# EasyEDA Pro project ProPrj_集成Windows Hello指纹、DIAL、HUB的桌面工具_2024-08-31.epro

# Schematic Schematic1
Create Date: 2024-07-15; Page Name: P1; Project Name: 集成Windows Hello指纹、DIAL、HUB的桌面工具; Schematic Name: Schematic1; Update Date: 2024-07-15; Company: 嘉立创EDA; Page Size: A3; Version: V1.0
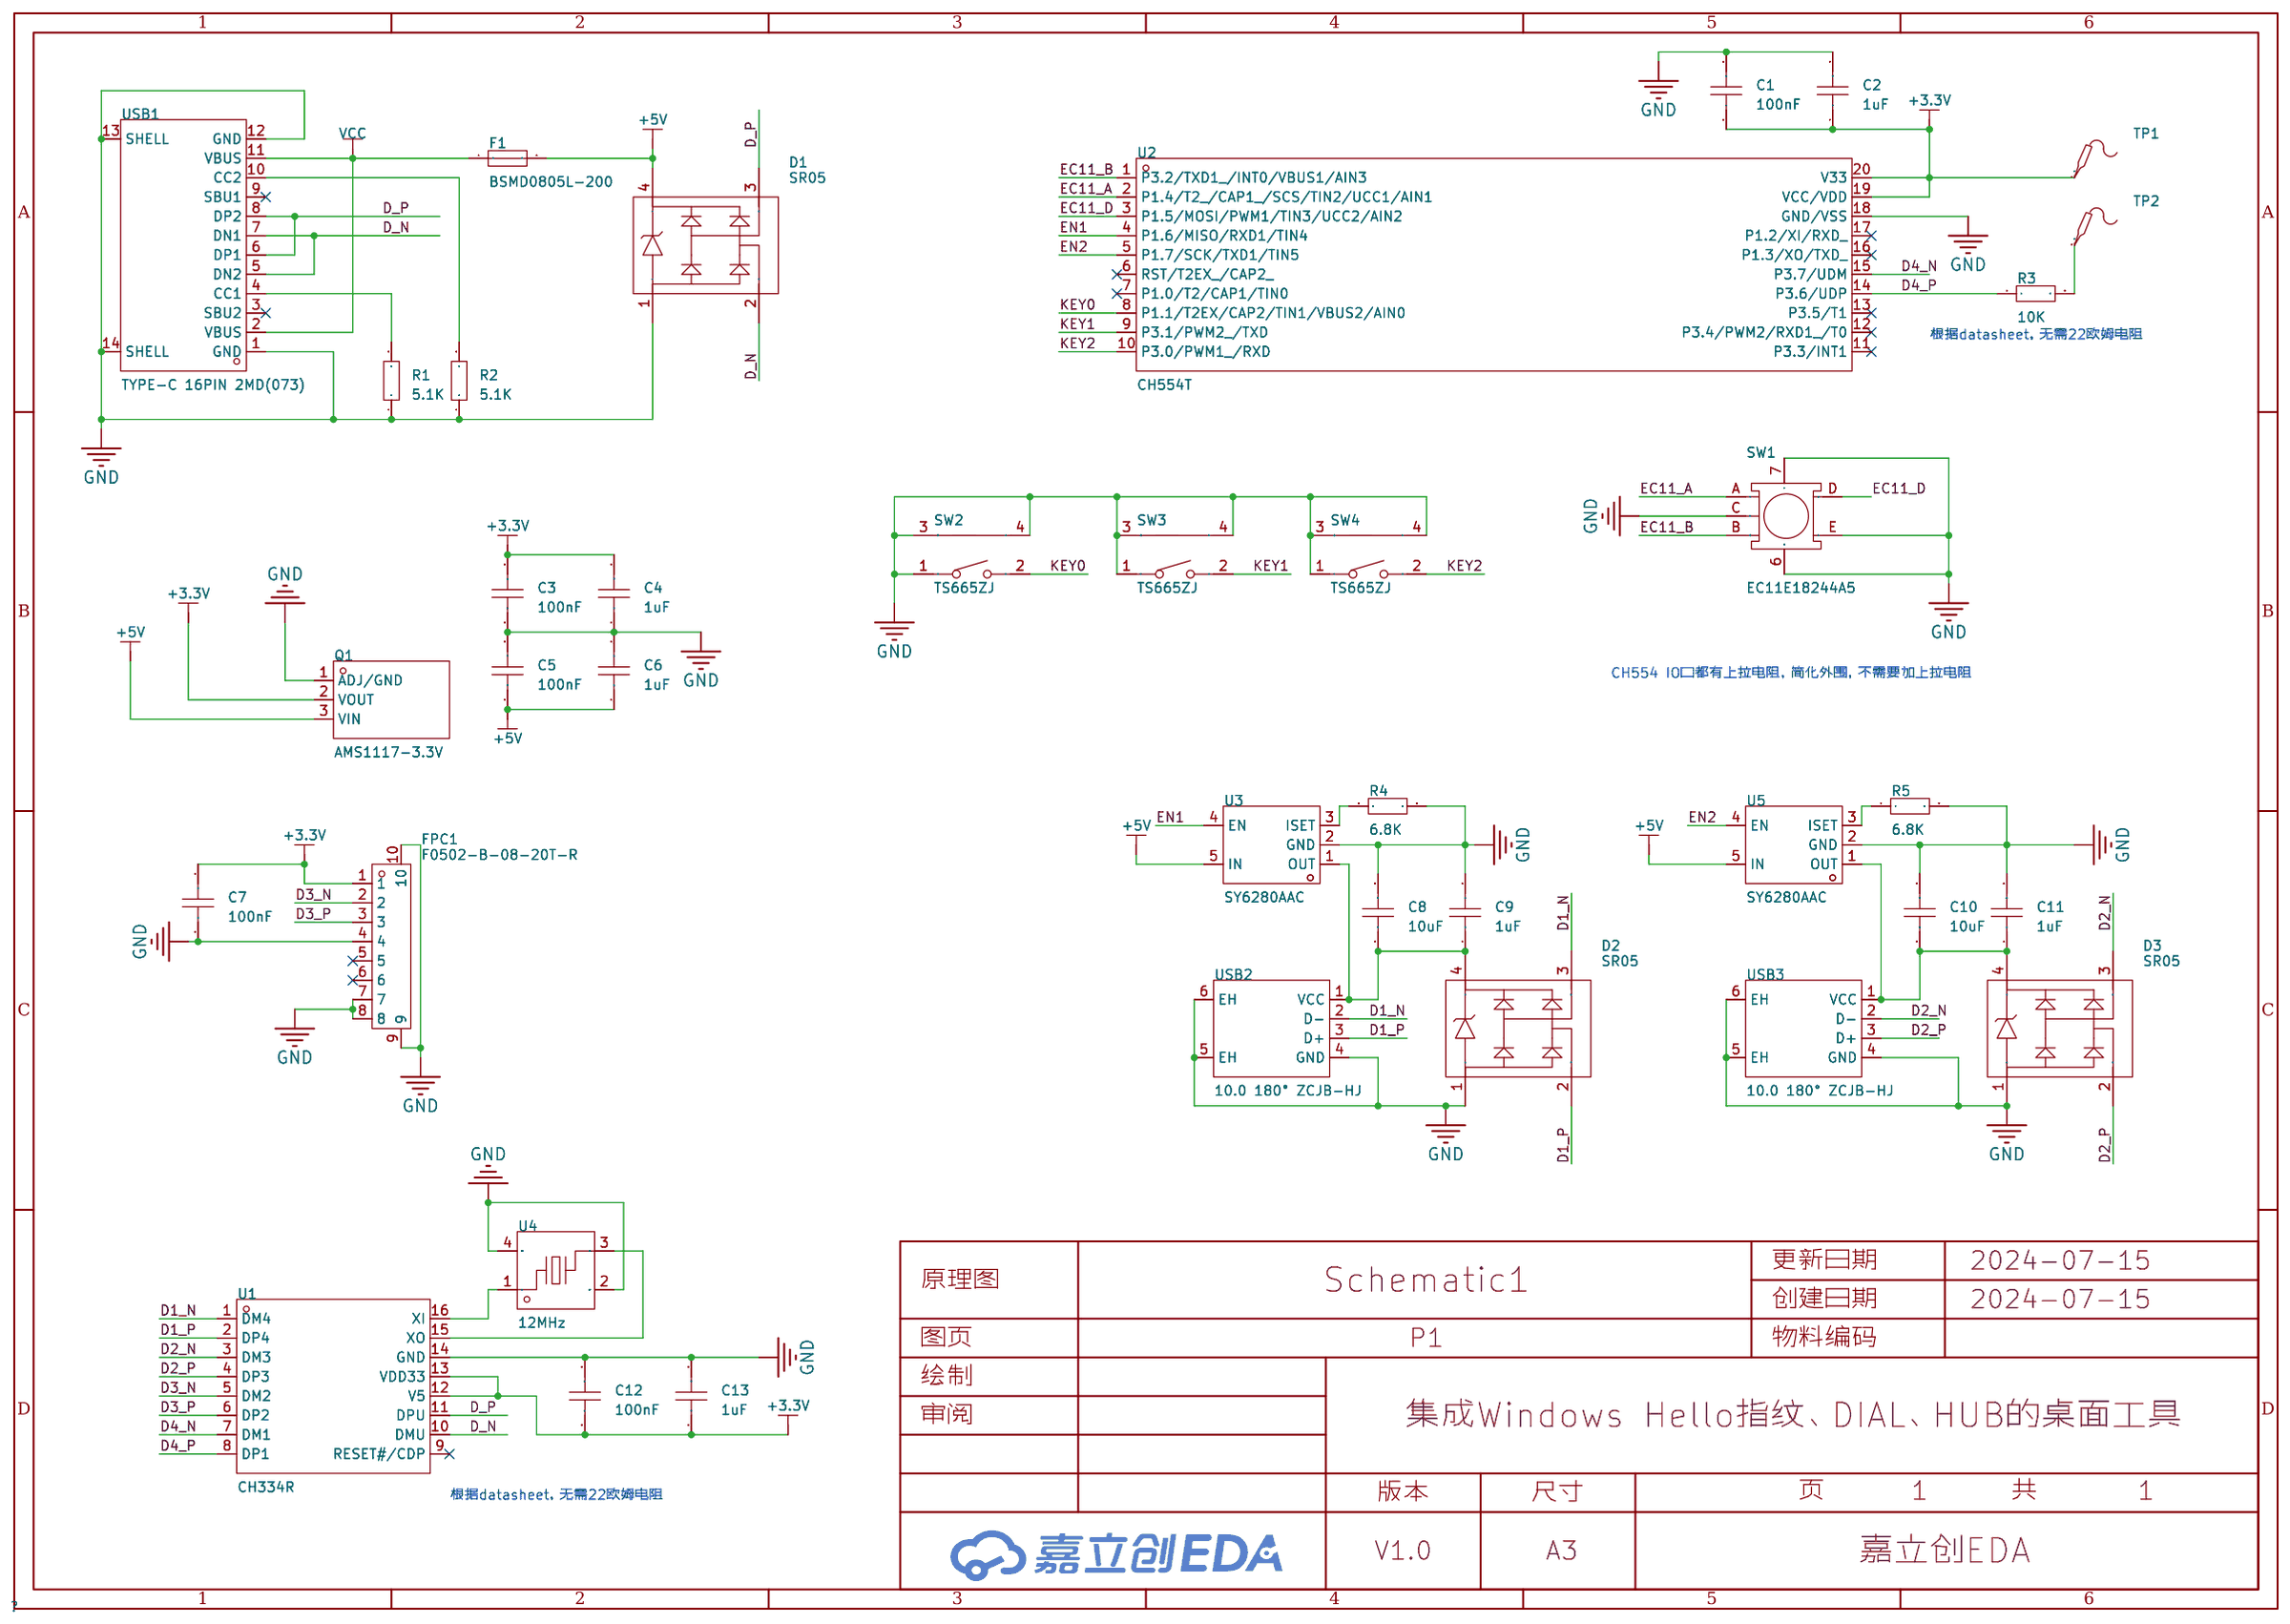
[diagram p0: schematic sheet]

## Parts
C1  100nF  [C0603]
C2  1uF  [C0603]
C3  100nF  [C0603]
C4  1uF  [C0603]
C5  100nF  [C0603]
C6  1uF  [C0603]
C7  100nF  [C0603]
C8  10uF  [C0603]
C9  1uF  [C0603]
C10  10uF  [C0603]
C11  1uF  [C0603]
C12  100nF  [C0603]
C13  1uF  [C0603]
D1  SR05  [SOT-143-4_L2.9-W1.3-P1.90-LS2.4-BL]
D2  SR05  [SOT-143-4_L2.9-W1.3-P1.90-LS2.4-BL]
D3  SR05  [SOT-143-4_L2.9-W1.3-P1.90-LS2.4-BL]
F1  BSMD0805L-200  [F0805]
FPC1  F0502-B-08-20T-R  [FPC-SMD_F0502-B-08-20T-R]
Q1  AMS1117-3.3V  [SOT-89-3_L4.5-W2.5-P1.50-LS4.2-BR]
R1  5.1K  [R0603]
R2  5.1K  [R0603]
R3  10K  [R0603]
R4  6.8K  [R0603]
R5  6.8K  [R0603]
SW1  EC11E18244A5  [SW-TH_EC11E18244A5]
SW2  TS665ZJ  [SW-TH_K2-1102BQ-G4CW-01]
SW3  TS665ZJ  [SW-TH_K2-1102BQ-G4CW-01]
SW4  TS665ZJ  [SW-TH_K2-1102BQ-G4CW-01]
TP1  -  [Test-Point-0.5mm]
TP2  -  [Test-Point-0.5mm]
U1  CH334R  [QSOP-16_L4.9-W3.9-P0.64-LS6.0-BL]
U2  CH554T  [TSSOP-20_L6.5-W4.4-P0.65-LS6.4-TL]
U3  SY6280AAC  [SOT-23-5_L3.0-W1.7-P0.95-LS2.8-BL]
U4  12MHz  [CRYSTAL-SMD_4P-L3.2-W2.5-BL]
U5  SY6280AAC  [SOT-23-5_L3.0-W1.7-P0.95-LS2.8-BL]
USB1  TYPE-C 16PIN 2MD(073)  [USB-C-SMD_TYPE-C-6PIN-2MD-073]
USB2  10.0 180° ZCJB-HJ  [USB-A-TH_ZCJB-HJ]
USB3  10.0 180° ZCJB-HJ  [USB-A-TH_ZCJB-HJ]

## Library data of the parts
C1-C13 = CAP_0603: Supplier Footprint: 0603
D1-D3 = SR05: Supplier Part: C782796; Manufacturer: SEMBO(深波); Supplier Footprint: SOT-143-4; JLCPCB Part Class: 扩展库; Datasheet: https://atta.szlcsc.com/upload/public/pdf/source/20210514/C782796_472BBF7C41E5A6E8ADB7E6EF91A8F050.pdf; Supplier: LCSC
F1 = BSMD0805L-200: 最大电压:6V;最大电流:50A;保持电流:2A;跳闸电流:4A;; LCSC Part Name: 6V 2A 0805自恢复; Supplier Part: C2757931; Manufacturer: BHFUSE(佰宏); Supplier Footprint: 0805; JLCPCB Part Class: 扩展库; Datasheet: https://atta.szlcsc.com/upload/public/pdf/source/20230512/2A38E917D8C71AC0E9EEF3F28FAD09E2.pdf; Supplier: LCSC; Operating Voltage (Max): 6V; Current Rating (Max): 50A; Hold Current: 2A; Trip Current: 4A; Power Dissipation: 1W; Resistance - Initial (Ri) (Min): 4mΩ; Resistance - Post Trip (R1) (Max): 45mΩ; Maximum Time to Trip: 5s; Operating Temperature: -40℃~+85℃
FPC1 = F0502-B-08-20T-R: 锁定特性:翻盖式;触点类型:下接;触点数量:8P;间距:0.5mm;安装类型:卧贴;; LCSC Part Name: 间距:0.5mm P数:8P 翻盖式 下接; Supplier Part: C481218; Manufacturer: XFCN(兴飞); Supplier Footprint: SMD,P=0.5mm,卧贴; JLCPCB Part Class: 扩展库; Datasheet: https://atta.szlcsc.com/upload/public/pdf/source/20200107/C481223_B24B2F420CEE1C498EA7D8BD00017249.pdf; Supplier: LCSC; Locking Feature: 翻盖式; Contact Type: 下接; Number of Contacts: 8P; Pitch: 0.5mm; Mounting Type: 卧贴; Height Above Board: 2mm
Q1 = AMS1117-3.3V_C5120796: 输出类型:固定;最大输入电压:18V;输出电压:3.3V;最大输出电流:1A;输出极性:正极;; LCSC Part Name: 输入18V 输出3.3V 1A; Supplier Part: C5120796; Manufacturer: MSKSEMI(美森科); Supplier Footprint: SOT-89; JLCPCB Part Class: 扩展库; Datasheet: https://atta.szlcsc.com/upload/public/pdf/source/20220727/5E62EAC46FFFF83337622C0FBE1B6BF8.pdf; Supplier: LCSC; Output Type: 固定; Maximum Input Voltage: 18V; Output Voltage: 3.3V; MAX Output Current: 1A; Dropout Voltage: 1.4V@(1A); standby current: 12mA; Operating Temperature: 0℃~+125℃; Output Polarity: 正极; Number of Outputs: 1
R1-R5 = Res_0603: Supplier Footprint: 0603
SW1 = EC11E18244A5: Supplier Part: C255515; Manufacturer: ALPSALPINE(阿尔卑斯阿尔派); Supplier Footprint: 插件; JLCPCB Part Class: 扩展库; Datasheet: https://atta.szlcsc.com/upload/public/pdf/source/20180717/C255515_FDB072715C920DA9BADE9D32EFEB8093.pdf; Supplier: LCSC
SW2-SW4 = TS665ZJ: 电路结构:单刀单掷;按钮形状:圆形按钮;作用力:250gf;安装方式:卧插;开关长度:6.2mm;开关宽度:6.2mm;开关高度:5mm;带支架:带支架;触点电流:50mA;额定电压(DC):12V;绝缘电阻:100MΩ;机械寿命:5万次;; LCSC Part Name: 6.2*6.2*5mm 卧插 轻触开关; Supplier Part: C557599; Manufacturer: SHOU HAN(首韩); Supplier Footprint: 插件; JLCPCB Part Class: 扩展库; Datasheet: https://atta.szlcsc.com/upload/public/pdf/source/20200519/C557599_C93058E34E1879225DC935A3AAEF7EAA.pdf; Supplier: LCSC; Circuit: 单刀单掷; Actuator Style: 圆形按钮; Operating Force: 250gf; Mounting Style: 卧插; Switch Length: 6.2mm; Switch Width: 6.2mm; Switch Height: 5mm; Strike Gundam: 带支架; Contact Current: 50mA; Voltage Rating (DC): 12V; Insulation Resistance: 100MΩ; Actuator/Cap Color: 黑色; Pin Style: PC引脚; Mechanical Life: 5万次
TP1 TP2 = Test-Point: Test Point 测试点
U1 = CH334R: Supplier Part: C4154405; Manufacturer: WCH(南京沁恒); Supplier Footprint: QSOP-16-150mil; JLCPCB Part Class: 扩展库; Datasheet: https://atta.szlcsc.com/upload/public/pdf/source/20240313/F70B229B132CE2CA6E618A7ACAF406E8.pdf; Supplier: LCSC
U2 = CH554T: Supplier Part: C2928938; Manufacturer: WCH(南京沁恒); Supplier Footprint: TSSOP-20; JLCPCB Part Class: 扩展库; Datasheet: https://atta.szlcsc.com/upload/public/pdf/source/20200819/C106886_FA0172974EAB526EA9ED6EAC69AA4F1B.pdf; Supplier: LCSC
U3 U5 = SY6280AAC_C55136: 低能耗配电开关; Supplier Part: C55136; Manufacturer: silergy(矽力杰); Supplier Footprint: SOT-23-5; JLCPCB Part Class: 扩展库; Datasheet: https://atta.szlcsc.com/upload/public/pdf/source/20161108/1478586372822.pdf; Supplier: LCSC
U4 = X322541201210A: 频率:12MHz;常温频差:±10ppm;外接负载电容:12pF;频率稳定度(全温):±30ppm;; LCSC Part Name: 12MHz ±10ppm 12pF; Supplier Part: C5128505; Manufacturer: Starwave(思大); Supplier Footprint: SMD3225-4P; JLCPCB Part Class: 扩展库; Datasheet: https://atta.szlcsc.com/upload/public/pdf/source/20220831/A7AEECC803A5F89437D8880B21203D0B.pdf; Supplier: LCSC; Normal temperature Frequency Tolerance: ±10ppm; External load capacitor: 12pF; Frequency Stability(Full temperature range): ±30ppm; Equivalent Series Resistance (ESR): 50Ω; Operating Temperature: -40℃~+85℃
USB1 = TYPE-C 16PIN 2MD(073): 连接器类型:Type-C;标准:-;公母:母;端口数量:1;触点数量:16P;安装方式:卧贴;额定电流 - 电源:5A;工作温度范围:-25℃~+85℃;; LCSC Part Name: Type-C 母 卧贴; Supplier Part: C2765186; Manufacturer: SHOU HAN(首韩); Supplier Footprint: SMD; JLCPCB Part Class: 扩展库; Datasheet: https://atta.szlcsc.com/upload/public/pdf/source/20211123/39B17C16241EAC15C5E277BDA434118E.pdf; Supplier: LCSC; Connector Type: Type-C; Gender: 母; Number of Ports: 1; Number of Contacts: 16P; Mounting Style: 卧贴; Current Rating - Power (Max): 5A; Operating Temperature Range: -25℃~+85℃
USB2 USB3 = 10.0 180° ZCJB-HJ: 连接器类型:Type-A;标准:USB 2.0;公母:母;端口数量:1;触点数量:4P;安装方式:直插;额定电流 - 电源:1.5A;工作温度范围:-25℃~+85℃;; LCSC Part Name: Type-A 母 直插; Supplier Part: C2681562; Manufacturer: SHOU HAN(首韩); Supplier Footprint: 插件; JLCPCB Part Class: 扩展库; Datasheet: https://atta.szlcsc.com/upload/public/pdf/source/20210122/C2681562_F87A6740E9F2C84060948B1B5DBCB2C0.pdf; Supplier: LCSC; Connector Type: Type-A; Standard: USB 2.0; Gender: 母; Number of Ports: 1; Number of Contacts: 4P; Mounting Style: 直插; Current Rating - Power (Max): 1.5A; Operating Temperature Range: -25℃~+85℃

## Nets
+3.3V: C1.1 C2.1 C3.2 C4.2 C7.1 C12.1 C13.1 FPC1.1 Q1.2(VOUT) TP1.1 U1.12(V5) U1.13(VDD33) U2.19(VCC/VDD) U2.20(V33)
+5V: C5.1 C6.1 D1.4 F1.2 Q1.3(VIN) U3.5(IN) U5.5(IN)
GND: C1.2 C2.2 C3.1 C4.1 C5.2 C6.2 C7.2 C8.2 C9.2 C10.2 C11.2 C12.2 C13.2 D1.1 D2.1 D3.1 FPC1.4 FPC1.7 FPC1.8 FPC1.9 FPC1.10 Q1.1(ADJ/GND) R1.1 R2.1 R4.2 R5.2 SW1.6 SW1.7 SW1.C SW1.E SW2.1 SW2.3 SW2.4 SW3.1 SW3.3 SW3.4 SW4.1 SW4.3 SW4.4 U1.14(GND) U2.18(GND/VSS) U3.2(GND) U4.2(GND) U4.4(GND) U5.2(GND) USB1.1(GND) USB1.12(GND) USB1.13(SHELL) USB1.14(SHELL) USB2.4(GND) USB2.5(EH) USB2.6(EH) USB3.4(GND) USB3.5(EH) USB3.6(EH)
VCC: F1.1 USB1.2(VBUS) USB1.11(VBUS)
D1_N: D2.3 U1.1(DM4) USB2.2(D-)
D1_P: D2.2 U1.2(DP4) USB2.3(D+)
D2_N: D3.3 U1.3(DM3) USB3.2(D-)
D2_P: D3.2 U1.4(DP3) USB3.3(D+)
D3_N: FPC1.2 U1.5(DM2)
D3_P: FPC1.3 U1.6(DP2)
D4_N: U1.7(DM1) U2.15(P3.7/UDM)
D4_P: R3.1 U1.8(DP1) U2.14(P3.6/UDP)
D_N: D1.2 U1.10(DMU) USB1.5(DN2) USB1.7(DN1)
D_P: D1.3 U1.11(DPU) USB1.6(DP1) USB1.8(DP2)
EC11_A: SW1.A U2.2(P1.4/T2_/CAP1_/SCS/TIN2/UCC1/AIN1)
EC11_B: SW1.B U2.1(P3.2/TXD1_/INT0/VBUS1/AIN3)
EC11_D: SW1.D U2.3(P1.5/MOSI/PWM1/TIN3/UCC2/AIN2)
EN1: U2.4(P1.6/MISO/RXD1/TIN4) U3.4(EN)
EN2: U2.5(P1.7/SCK/TXD1/TIN5) U5.4(EN)
KEY0: SW2.2 U2.8(P1.1/T2EX/CAP2/TIN1/VBUS2/AIN0)
KEY1: SW3.2 U2.9(P3.1/PWM2_/TXD)
KEY2: SW4.2 U2.10(P3.0/PWM1_/RXD)
$1N1071: R1.2 USB1.4(CC1)
$1N1075: R2.2 USB1.10(CC2)
$1N1604: U1.16(XI) U4.1
$1N1608: U1.15(XO) U4.3
$1N3135: C10.1 C11.1 D3.4 U5.1(OUT) USB3.1(VCC)
$1N3142: C8.1 C9.1 D2.4 U3.1(OUT) USB2.1(VCC)
$1N3230: R5.1 U5.3(ISET)
$1N3240: R4.1 U3.3(ISET)
$1N4441: R3.2 TP2.1

Not connected (* = marked no-connect by the designer): FPC1 5* 6*; U1 9(RESET#/CDP)*; U2 6(RST/T2EX_/CAP2_)* 7(P1.0/T2/CAP1/TIN0)* 11(P3.3/INT1)* 12(P3.4/PWM2/RXD1_/T0)* 13(P3.5/T1)* 16(P1.3/XO/TXD_)* 17(P1.2/XI/RXD_)*; USB1 3(SBU2)* 9(SBU1)*

## Notes on the sheet
- 根据datasheet，无需22欧姆电阻
- CH554 IO口都有上拉电阻，简化外围，不需要加上拉电阻
- 根据datasheet，无需22欧姆电阻

# Board PCB1
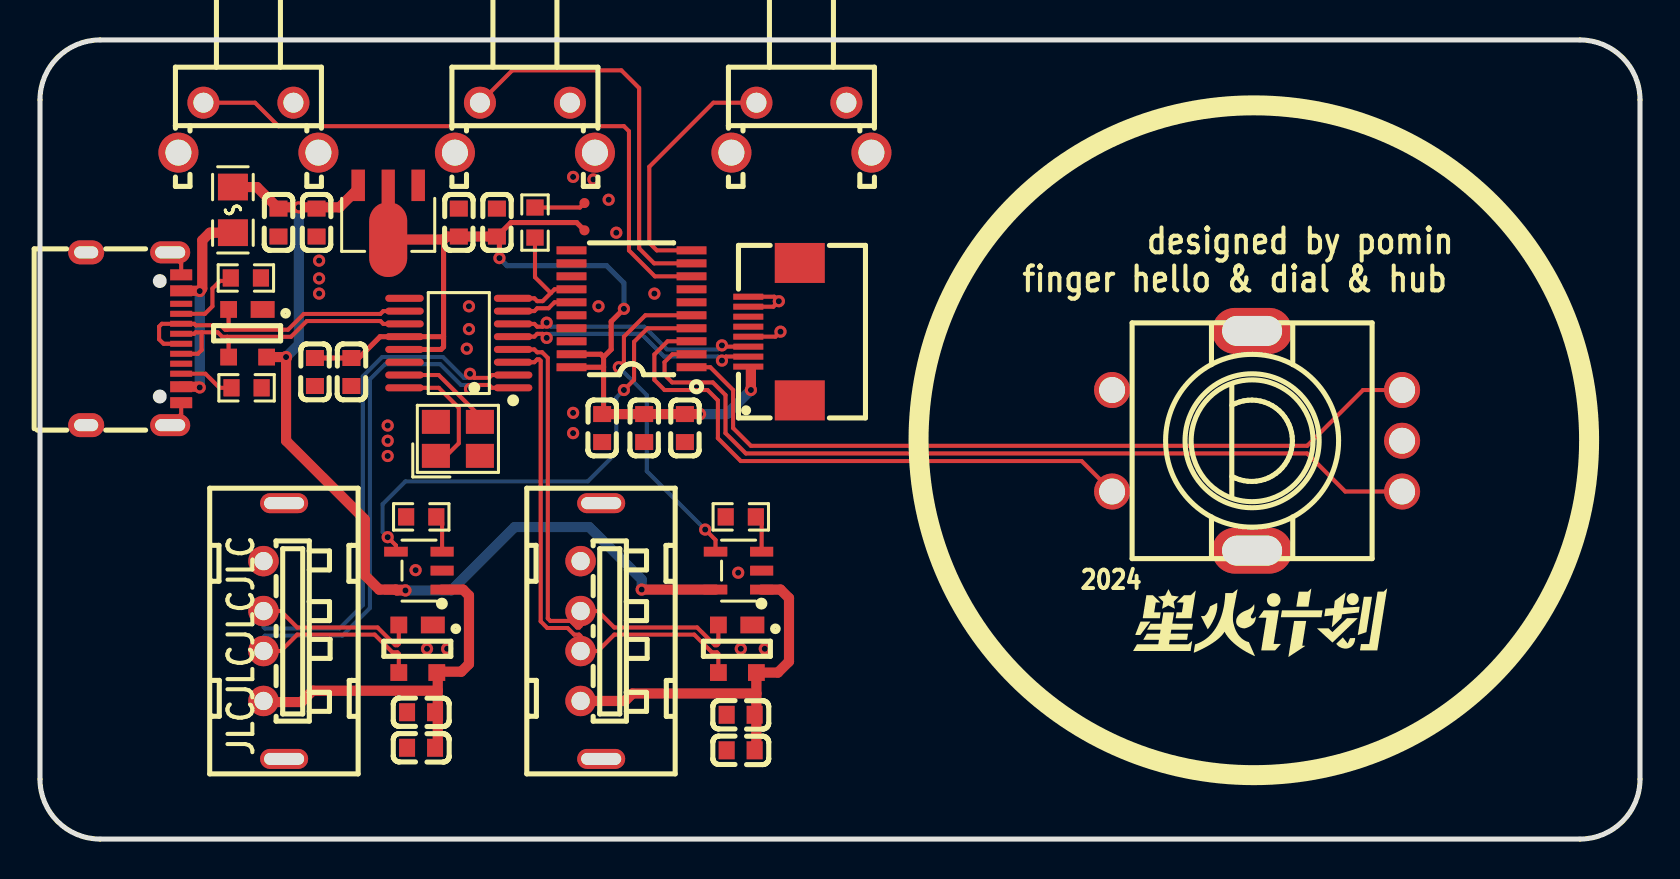
[diagram p1: board, top side]
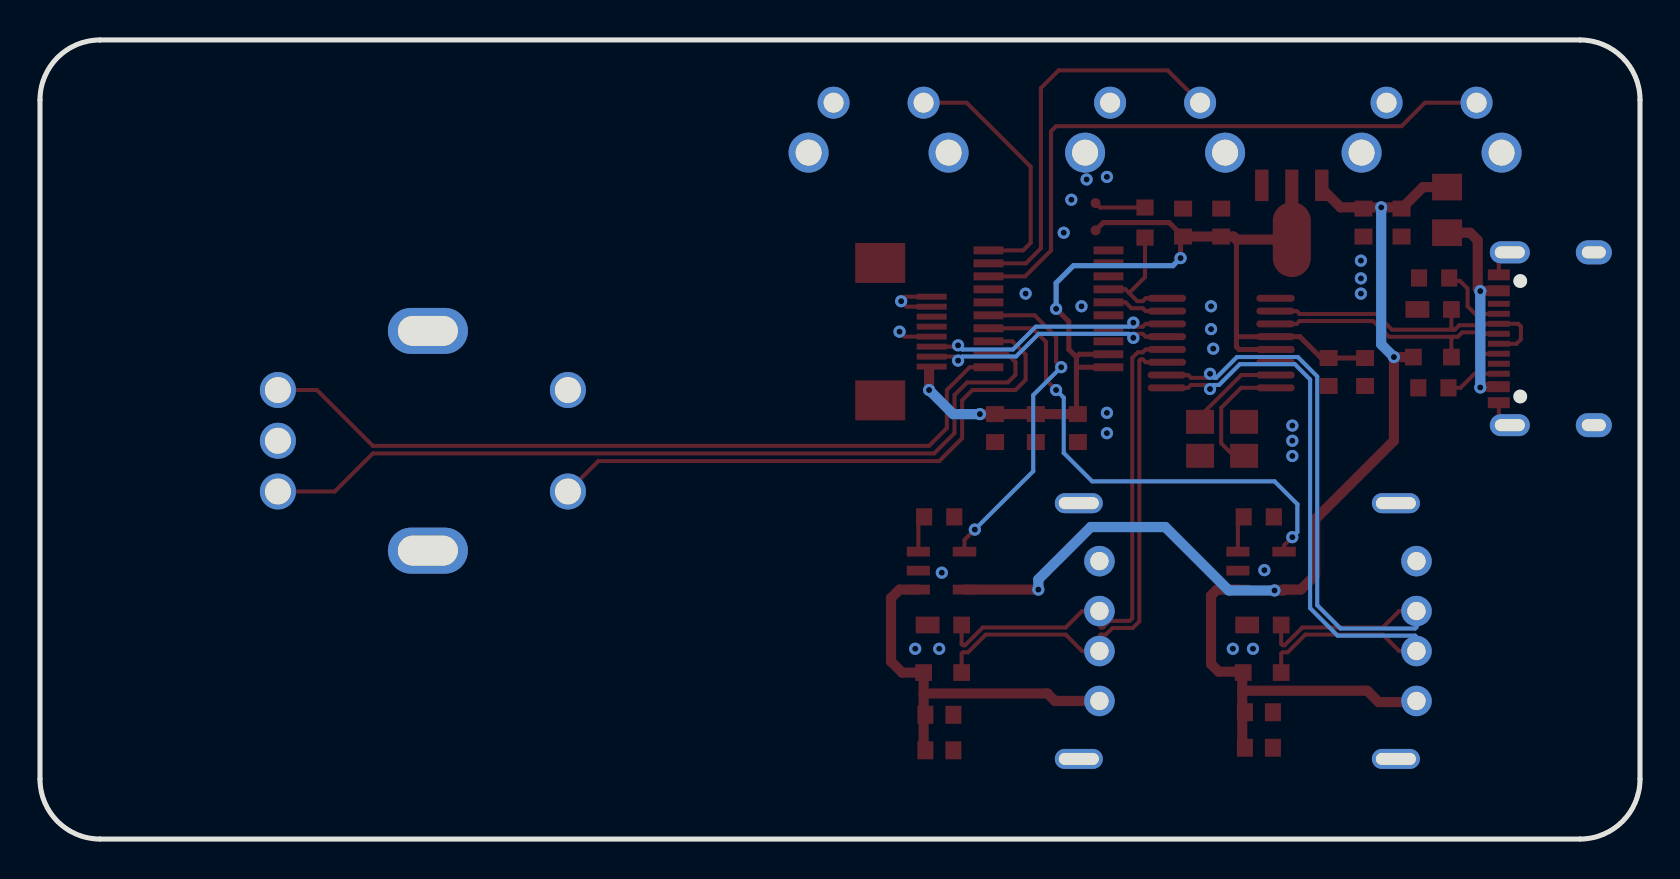
[diagram p2: board, bottom side, seen from below]

Outline 80 x 40 mm; copper layers: Top Layer, Bottom Layer. Coordinates in mm from the lower left corner of the outline.
Outline path: 0,37 arc(0.88,39.12) 3,40 77,40 arc(79.12,39.12) 80,37 80,3 arc(79.12,0.88) 77,0 3,0 arc(0.88,0.88) 0,3 0,37
Stack: Top Layer 0.035mm / Dielectric1 1.51mm FR4 er 4.5 / Bottom Layer 0.035mm

## Design rules (mm)
net D1_N: DP5
net D1_P: DP5
net D2_N: DP4
net D2_P: DP4
net D3_N: DP3
net D3_P: DP3
net D4_N: DP2
net D4_P: DP2
net D_P: DP1
net D_N: DP1
template: JLCPCB Capability(Two Layers Board)
spacing copperThickness1oz (default): track to track 0.102, other pairs 0.152 to 0.3
spacing copperThickness2oz: track to track 0.203, other pairs 0.152 to 0.3
track width copperThickness1oz (default): min 0.127, default 0.254, max 2.54
track width copperThickness2oz: min 0.203, default 0.254, max 2.54
differential pair differentialPair (default): width min 0.127, default 0.254, max 2.54; gap min 0.152, default 0.152
via viaSize (default): diameter min 0.5, default 0.61, max 10; hole min 0.3, default 0.305, max 6.3

## Placement (name value [footprint] x y rotation side)
C1  100nF  [C0603]  28.11 20.57 270 top
C2  1uF  [C0603]  30.21 20.57 270 top
C3  100nF  [C0603]  22.85 30.86 270 top
C4  1uF  [C0603]  20.94 30.86 270 top
C5  100nF  [C0603]  13.83 30.86 270 top
C6  1uF  [C0603]  11.92 30.86 270 top
C7  100nF  [C0603]  32.25 20.57 270 top
C8  10uF  [C0603]  19.05 6.35 180 top
C9  1uF  [C0603]  19.05 4.57 180 top
C10  10uF  [C0603]  35.03 6.22 180 top
C11  1uF  [C0603]  35.03 4.44 180 top
C12  100nF  [C0603]  15.57 23.38 270 top
C13  1uF  [C0603]  13.75 23.38 270 top
D1  SR05  [SOT-143-4_L2.9-W1.3-P1.90-LS2.4-BL]  10.38 25.32 180 top
D2  SR05  [SOT-143-4_L2.9-W1.3-P1.90-LS2.4-BL]  18.89 9.52 180 top
D3  SR05  [SOT-143-4_L2.9-W1.3-P1.90-LS2.4-BL]  34.87 9.52 180 top
F1  BSMD0805L-200  [F0805]  9.65 31.49 90 top
FPC1  F0502-B-08-20T-R  [FPC-SMD_F0502-B-08-20T-R]  36.7 25.4 90 top
Q1  AMS1117-3.3V  [SOT-89-3_L4.5-W2.5-P1.50-LS4.2-BR]  17.41 31.37 90 top
R1  5.1K  [R0603]  10.29 28.08 180 top
R2  5.1K  [R0603]  10.33 22.59 180 top
R3  10K  [R0603]  24.75 30.86 90 top
R4  6.8K  [R0603]  19.06 16.13 180 top
R5  6.8K  [R0603]  35.04 16.13 180 top
SW1  EC11E18244A5  [SW-TH_EC11E18244A5]  60.86 19.94 90 top
SW2  TS665ZJ  [SW-TH_K2-1102BQ-G4CW-01]  10.42 35.61 180 top
SW3  TS665ZJ  [SW-TH_K2-1102BQ-G4CW-01]  24.25 35.61 180 top
SW4  TS665ZJ  [SW-TH_K2-1102BQ-G4CW-01]  38.07 35.61 180 top
TP1  -  [Test-Point-0.5mm]  27.22 30.47 180 top
TP2  -  [Test-Point-0.5mm]  27.22 31.84 180 top
U1  CH334R  [QSOP-16_L4.9-W3.9-P0.64-LS6.0-BL]  20.94 24.83 90 top
U2  CH554T  [TSSOP-20_L6.5-W4.4-P0.65-LS6.4-TL]  29.58 26.54 180 top
U3  SY6280AAC  [SOT-23-5_L3.0-W1.7-P0.95-LS2.8-BL]  18.95 13.44 90 top
U4  12MHz  [CRYSTAL-SMD_4P-L3.2-W2.5-BL]  20.9 20.03 0 top
U5  SY6280AAC  [SOT-23-5_L3.0-W1.7-P0.95-LS2.8-BL]  34.93 13.44 90 top
USB1  TYPE-C 16PIN 2MD(073)  [USB-C-SMD_TYPE-C-6PIN-2MD-073]  4.68 25.04 270 top
USB2  10.0 180° ZCJB-HJ  [USB-A-TH_ZCJB-HJ]  11.69 10.41 90 top
USB3  10.0 180° ZCJB-HJ  [USB-A-TH_ZCJB-HJ]  27.54 10.41 90 top

## Footprints (pads in the part's own frame, mm; a bottom-side part is the same pattern mirrored in y, then rotated)
C0603
  rect 0.8x0.9 smd: 1(-0.7,0) 2(0.7,0)
CRYSTAL-SMD_4P-L3.2-W2.5-BL
  rect 1.4x1.2 smd: 1(-1.1,-0.85) 2(1.1,-0.85) 3(1.1,0.85) 4(-1.1,0.85)
F0805
  rect 1.335x1.5 smd: 1(-1.143,0) 2(1.143,0)
FPC-SMD_F0502-B-08-20T-R
  rect 0.3x1.5 smd: 1(-1.75,1.288) 2(-1.25,1.288) 3(-0.75,1.288) 4(-0.25,1.288) 5(0.25,1.288) 6(0.75,1.288) 7(1.25,1.288) 8(1.75,1.288)
  rect 2x2.5 smd: 9(3.44,-1.288) 10(-3.44,-1.288)
QSOP-16_L4.9-W3.9-P0.64-LS6.0-BL
  oval 0.35x1.921 smd: 1(-2.24,-2.716) 2(-1.6,-2.716) 3(-0.96,-2.716) 4(-0.32,-2.716) 5(0.32,-2.716) 6(0.96,-2.716) 7(1.6,-2.716) 8(2.24,-2.716) 9(2.24,2.716) 10(1.6,2.716) 11(0.96,2.716) 12(0.32,2.716) 13(-0.32,2.716) 14(-0.96,2.716) 15(-1.6,2.716) 16(-2.24,2.716)
R0603
  rect 0.806x0.864 smd: 1(-0.753,0) 2(0.753,0)
SOT-23-5_L3.0-W1.7-P0.95-LS2.8-BL
  rect 0.49x1.157 smd: 1(-0.95,-1.153) 2(0,-1.153) 3(0.95,-1.153)
  rect 0.49x1.175 smd: 4(0.95,1.153) 5(-0.95,1.153)
SOT-89-3_L4.5-W2.5-P1.50-LS4.2-BR
  rect 1.575x0.672 smd: 1(1.356,-1.5) 3(1.356,1.5)
  custom 5.377x1.9 smd: 2(-1.356,0)
SOT-143-4_L2.9-W1.3-P1.90-LS2.4-BL
  rect 1.194x0.838 smd: 1(-0.75,-1.192)
  rect 0.838x0.838 smd: 2(0.95,-1.192) 3(0.95,1.192) 4(-0.95,1.192)
SW-TH_EC11E18244A5
  oval 2.3x4 hole 1.5x3: 6(5.5,0.25) 7(-5.5,0.25)
  round 1.8 hole 1.3: A(-2.54,-7.25) B(2.54,-7.25) C(0,-7.25) D(-2.54,7.25) E(2.54,7.25)
SW-TH_K2-1102BQ-G4CW-01
  round 1.6 hole 1: 1(-2.25,-1.25) 2(2.25,-1.25)
  round 2 hole 1.3: 3(3.5,1.25) 4(-3.5,1.25)
Test-Point-0.5mm
  round 0.5 smd: 1(0,0)
TSSOP-20_L6.5-W4.4-P0.65-LS6.4-TL
  rect 1.494x0.4 smd: 1(-3.001,2.925) 2(-3.001,2.275) 3(-3.001,1.625) 4(-3.001,0.975) 5(-3.001,0.325) 6(-3.001,-0.324) 7(-3.001,-0.975) 8(-3.001,-1.625) 9(-3.001,-2.275) 10(-3.001,-2.925) 11(3.001,-2.925) 12(3.001,-2.275) 13(3.001,-1.625) 14(3.001,-0.975) 15(3.001,-0.325) 16(3.001,0.325) 17(3.001,0.975) 18(2.996,1.625) 19(2.996,2.275) 20(3.001,2.925)
USB-A-TH_ZCJB-HJ
  round 1.524 hole 0.914: 1(-3.5,0.515) 2(-1.001,0.515) 3(1,0.515) 4(3.5,0.515)
  oval 1x2.4 hole 0.6x2: 5(-6.4,-0.515) 6(6.4,-0.515)
USB-C-SMD_TYPE-C-6PIN-2MD-073
  rect 0.55x1.1 smd: 1(-3.2,2.375) 2(-2.4,2.375) 11(2.4,2.375) 12(3.2,2.375)
  rect 0.3x1.1 smd: 3(-1.75,2.375) 4(-1.25,2.375) 5(-0.75,2.375) 6(-0.25,2.375) 7(0.25,2.375) 8(0.75,2.375) 9(1.25,2.375) 10(1.75,2.375)
  oval 1.1x2 hole 0.6x1.5: 13(-4.325,1.825) 14(4.325,1.825)
  oval 1.2x1.8 hole 0.6x1.2: 13(-4.325,-2.375) 14(4.325,-2.375)

## Nets
As in the schematic.

Pads without a net: FPC1 5 6; U1 9; U2 6 7 11 12 13 16 17; USB1 3 9

## Via types
v1: diameter 0.61, hole 0.305, Top Layer to Bottom Layer, 45 vias

## Routing (per net, layer and track width the routed paths; a pad name or vN(x,y) marks a point on that pad's centre or on a via; arc(x,y) is an arc through that point)
+3.3V: length 51.7
  Top Layer w0.254: C1.1 28.18,21.34 28.18,23.64 ; 28.18,24.13 28.18,23.64 ; 28.18,24.13 28.04,24.27 U2.19 ; 28.18,24.13 28.56,24.51 28.56,25.91 v1(29.2,26.54) ; 28.18,23.64 28.16,23.62 U2.20 ; 20.18,25.15 U1.12 17.01,25.15 15.94,24.08 13.75,24.08 ; 20.18,25.15 20.18,24.64 20.05,24.51 U1.13 ; 20.18,25.15 20.18,30.01 ; TP1.1 26.83,30.86 23.55,30.86 C3.2 22.97,30.03 v1(22.97,29.08)
  Top Layer w0.508: C3.2 C4.2 20.33,30.16 20.18,30.01 17.41,30.01 ; v1(35.55,22.48) 35.55,23.49 ; C1.1 C2.1 C7.1 v1(33.01,21.27)
  Bottom Layer w0.254: v1(29.2,26.54) 29.2,27.83 28.33,28.7 23.35,28.7 v1(22.97,29.08)
  Bottom Layer w0.508: v1(33.01,21.27) 34.34,21.27 v1(35.55,22.48)
+5V: length 49.4
  Top Layer w0.508: 11.33,24.13 v1(12.3,24.13) 12.3,19.94 16.24,16 16.24,13.21 16.96,12.49 17.8,12.49 17.84,12.44 v1(18.27,12.44) ; F1.2 10.85,32.64 11.86,31.62 ; 11.86,31.62 C6.1 ; 11.86,31.62 v1(12.94,31.62) 14.97,31.62 15.91,32.56 Q1.3 ; 33.77,12.49 v1(30.08,12.49)
  Bottom Layer w0.508: v1(12.3,24.13) 12.94,24.76 v1(12.94,31.62) ; v1(30.08,12.49) 30.08,12.99 27.46,15.62 23.73,15.62 20.56,12.44 v1(18.27,12.44)
GND: length 7.7
  Top Layer w0.203: USB1.12 7.06,21.27 USB1.14 ; FPC1.7 36.67,26.65 v1(36.94,26.92) 36.72,27.15 FPC1.8 ; v1(37.02,25.4) 36.77,25.15 FPC1.4 ; USB1.1 7.06,28.82 USB1.13
  vias: v1(13.95,28.95) v1(13.95,28.06) v1(13.95,27.3) v1(17.38,20.7) v1(17.38,19.94) v1(17.38,19.17) v1(18.78,13.46) v1(19.35,9.52) v1(20.36,9.52) v1(21.34,24.55) v1(21.45,26.67) v1(21.45,25.52) v1(26.66,33.14) v1(26.66,21.33) v1(26.66,20.32) v1(27.67,33.02) v1(27.92,26.67) v1(28.43,32) v1(28.81,30.35) v1(30.72,27.3) v1(34.91,13.33) v1(35.04,9.52) v1(36.24,9.52)
VCC: length 11
  Top Layer w0.508: F1.1 8.49,30.35 8.11,29.97 8.11,27.56 8,27.44 USB1.2 ; v1(7.99,22.6) 7.95,22.64 USB1.11
  Bottom Layer w0.508: v1(7.99,27.43) v1(7.99,22.6)
D1_N: length 34.7
  Top Layer w0.203: USB2.2 12.04,9.41 12.86,10.23 16.73,10.23 17.62,9.35 17.87,9.35 17.94,9.27 D2.3 ; U1.1 22.59,22.59 22.45,22.73 21.7,22.73 v1(21.5,22.53)
  Bottom Layer w0.203: v1(21.5,22.53) 21.3,22.73 21.05,22.73 20,23.77 17.26,23.77 16.5,23.01 16.5,11.56 15.12,10.18 11.25,10.18 11.18,10.11 USB2.2
D1_P: length 34.8
  Top Layer w0.203: D2.2 17.94,9.77 17.87,9.7 17.77,9.7 16.88,10.59 12.86,10.59 12.04,11.41 USB2.3 ; U1.2 22.59,23.23 22.45,23.08 21.7,23.08 v1(21.5,23.29)
  Bottom Layer w0.203: v1(21.5,23.29) 21.3,23.08 21.19,23.08 20.15,24.13 17.11,24.13 16.14,23.16 16.14,11.71 14.97,10.54 11.25,10.54 11.18,10.61 USB2.3
D2_N: length 26.1
  Top Layer w0.203: 33.92,8.33 33.92,9.27 33.85,9.35 33.6,9.35 32.71,10.23 28.72,10.23 27.89,9.41 USB3.2 27.03,10.16 26.96,10.23 26.71,10.23 26.38,10.56 25.36,10.56 25.03,10.89 25.03,23.94 24.96,24.01 24.86,24.01 24.72,23.87 U1.3
D2_P: length 26.1
  Top Layer w0.203: U1.4 24.72,24.51 24.86,24.36 25.11,24.36 25.39,24.08 25.39,11.04 25.51,10.92 26.52,10.92 26.86,10.59 26.96,10.59 27.03,10.66 USB3.3 27.89,11.41 28.72,10.59 32.86,10.59 33.75,9.7 33.85,9.7 33.92,9.77 33.92,10.72
D3_N: length 12.6
  Top Layer w0.203: U1.5 24.72,25.15 24.86,25.29 25.13,25.29 v1(25.33,25.09) ; v1(34.1,23.95) 34.3,24.15 35.41,24.15 FPC1.2
  Bottom Layer w0.203: v1(34.1,23.95) 33.89,24.15 31.2,24.15 30.07,25.29 25.54,25.29 v1(25.33,25.09)
D3_P: length 12.6
  Top Layer w0.203: FPC1.3 34.16,24.65 v1(34.1,24.71) ; U1.6 24.72,25.79 24.86,25.64 25.13,25.64 v1(25.33,25.85)
  Bottom Layer w0.203: v1(34.1,24.71) 33.89,24.51 31.35,24.51 30.21,25.64 25.54,25.64 v1(25.33,25.85)
D4_N: length 3.1
  Top Layer w0.203: U1.7 24.72,26.43 24.86,26.57 25.43,26.57 25.73,26.87 U2.15
D4_P: length 6.3
  Top Layer w0.203: U1.8 24.72,27.07 24.86,26.92 25.14,26.92 25.54,27.33 ; R3.1 24.75,28.13 25.54,27.33 ; 25.54,27.33 25.73,27.52 U2.14
D_N: length 15.7
  Top Layer w0.203: 9.36,25.5 12.4,25.5 13.19,26.28 17.02,26.28 17.16,26.43 U1.10 ; 9.36,25.5 9.26,25.5 9.03,25.72 7.78,25.72 7.71,25.79 USB1.5 6.09,25.79 5.95,25.65 5.95,25.02 6.18,24.79 USB1.7 ; 9.36,25.5 9.43,25.57 D1.2
D_P: length 14.7
  Top Layer w0.203: 8.09,25.36 8.09,24.48 7.9,24.29 USB1.8 ; 8.09,25.36 7.78,25.36 7.71,25.29 USB1.6 ; 8.09,25.36 8.89,25.36 9.11,25.14 9.36,25.14 ; U1.11 17.16,25.79 17.02,25.93 13.34,25.93 12.55,25.14 9.36,25.14 ; 9.36,25.14 9.43,25.07 9.43,24.13
EC11_A: length 42.6
  Top Layer w0.203: U2.2 31.62,24.27 31.23,23.87 31.23,23.24 31.61,22.86 33.64,22.86 34.27,22.22 34.27,20.32 35.29,19.3 63.36,19.3 65.26,17.4 SW1.A
EC11_B: length 39.1
  Top Layer w0.203: U2.1 33.52,23.62 34.66,22.48 34.66,20.57 35.55,19.68 63.36,19.68 66.15,22.48 67.8,22.48
EC11_D: length 29.7
  Top Layer w0.203: SW1.D 52.08,18.92 35.04,18.92 33.89,20.06 33.89,21.96 33.38,22.48 31.23,22.48 30.72,22.98 30.72,24.25 31.38,24.92 U2.3
EN1: length 24.5
  Top Layer w0.203: U3.4 17.8,14.7 v1(17.38,15.11) ; U2.4 30.38,25.57 29.7,24.89 29.7,22.98 v1(29.2,22.48)
  Bottom Layer w0.203: v1(17.38,15.11) 17.13,15.36 17.13,16.76 18.27,17.9 27.39,17.9 28.81,19.33 28.81,22.1 v1(29.2,22.48)
EN2: length 16.7
  Top Layer w0.203: 33.77,14.39 33.77,14.98 v1(33.26,15.49) ; v1(28.94,23.62) 29.2,23.87 29.2,25.14 30.27,26.22 U2.5
  Bottom Layer w0.203: v1(33.26,15.49) 30.34,18.41 30.34,22.22 v1(28.94,23.62)
KEY0: length 31.5
  Top Layer w0.203: 8.17,36.86 10.75,36.86 11.92,35.68 29.2,35.68 29.45,35.43 29.45,29.46 30.74,28.17 U2.8
KEY1: length 20
  Top Layer w0.203: SW3.2 23.62,38.48 29.07,38.48 29.96,37.59 29.96,29.57 30.71,28.82 U2.9
KEY2: length 12.8
  Top Layer w0.203: U2.10 30.84,29.47 30.47,29.84 30.47,33.65 33.67,36.86 SW4.2
$1N1071: length 3.7
  Top Layer w0.203: R1.2 9.39,27.94 9,27.94 8.62,27.56 8.62,26.67 8.25,26.29 USB1.4
$1N1075: length 2.8
  Top Layer w0.203: R2.2 8.98,22.59 8.27,23.29 USB1.10
$1N1604: length 6.3
  Top Layer w0.203: U1.16 19.94,22.59 20.94,21.59 20.94,19.81 20.31,19.18 19.8,19.18
$1N1608: length 4.9
  Top Layer w0.203: U1.15 19.94,23.23 22,21.17 U4.3
$1N3135: length 19.2
  Top Layer w0.508: 35.82,7.29 35.82,4.78 35.73,4.7 ; 35.82,7.29 29.63,7.29 29.25,6.91 USB3.1 ; 35.82,7.29 D3.4 36.9,8.33 37.45,8.89 37.45,12.06 37.03,12.49 36.08,12.49
$1N3142: length 19.4
  Top Layer w0.508: 19.75,4.7 19.89,4.83 19.89,7.43 ; 19.89,8.38 D2.4 ; 19.89,8.38 19.89,7.43 ; 19.89,8.38 21.07,8.38 21.45,8.76 21.45,12.19 21.15,12.49 20.1,12.49 ; USB2.1 11.23,6.86 13.07,6.86 13.64,7.43 19.89,7.43
$1N3230: length 1.9
  Top Layer w0.203: R5.1 36.08,15.84 U5.3
$1N3240: length 1.9
  Top Layer w0.203: 19.82,16.13 20.1,15.84 U3.3
$1N4441: length 2.6
  Top Layer w0.203: TP2.1 27,31.61 R3.2

## Copper pours and planes (outline as drawn; the poured copper is in the pictures)
GND on Top Layer: 76.95,42.67 83.3,36.32 83.3,2.28 78.98,-2.03 2.65,-2.03 -1.92,2.54 -1.92,40.64 0.11,42.67
GND on Bottom Layer: 77.01,42.67 83.36,36.32 83.36,2.28 79.04,-2.03 2.72,-2.03 -1.86,2.54 -1.86,40.64 0.18,42.67

## Text on the board
Top Silkscreen Layer: 2024 | finger hello & dial & hub | designed by pomin | JLCJLCJLCJLC

# Board top
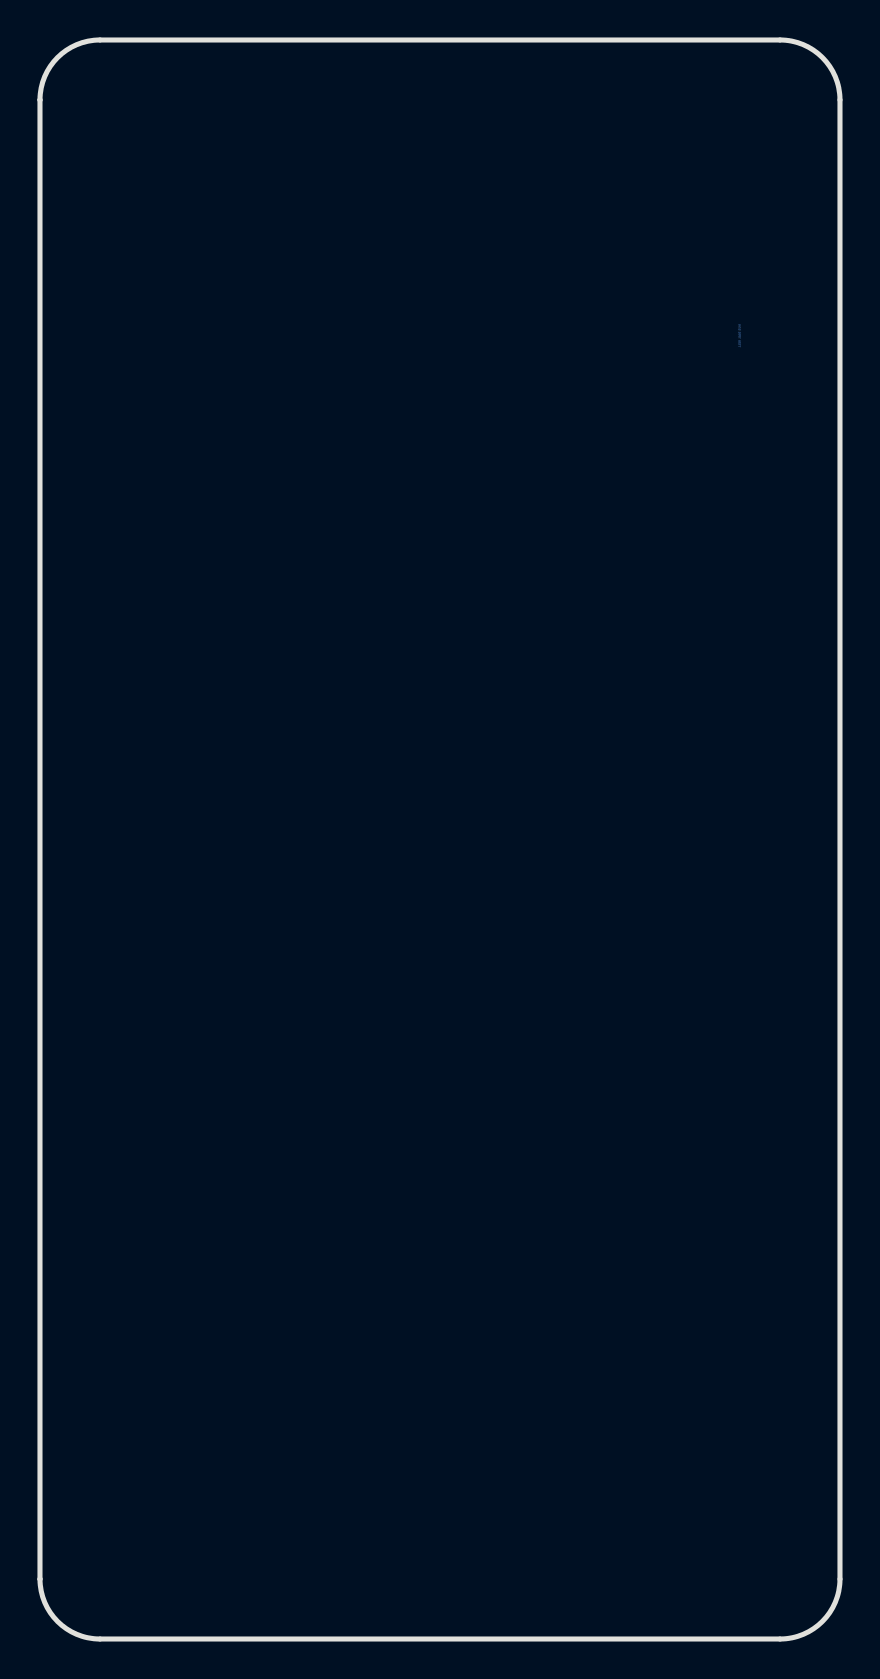
[diagram p3: board, top side]
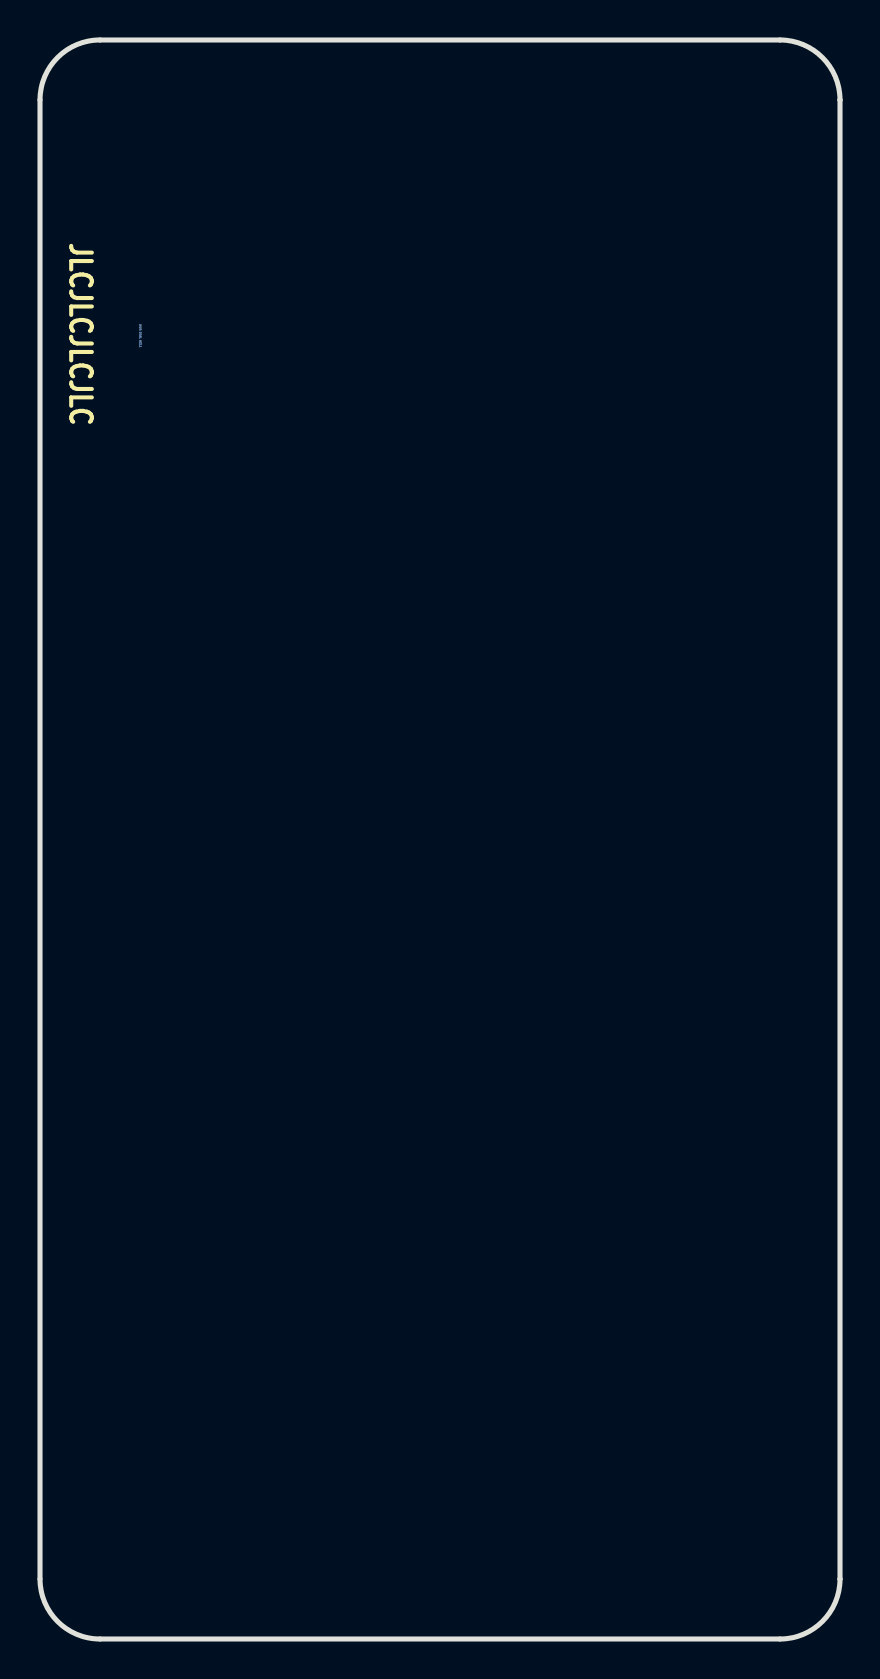
[diagram p4: board, bottom side, seen from below]

Outline 40 x 80 mm; copper layers: Top Layer, Bottom Layer. Coordinates in mm from the lower left corner of the outline.
Outline path: 0,3 0,77 arc(0.88,79.12) 3,80 37,80 arc(39.12,79.12) 40,77 40,3 arc(39.12,0.88) 37,0 3,0 arc(0.88,0.88) 0,3
Stack: Top Layer 0.035mm / Dielectric1 1.51mm FR4 er 4.5 / Bottom Layer 0.035mm

## Design rules (mm)
spacing Default (default): track to track 0.152, other pairs 0 to 0.152
track width Default (default): min 0.254, default 0.254, max 25.4
differential pair differentialPair (default): width min 0.127, default 0.254, max 2.54; gap min 0.152, default 0.152
via Default (default): diameter min 0.61, default 0.61, max 100.025; hole min 0.305, default 0.305, max 59.995
net GND uses gge44060(1)
pour e4 uses gge44060
pour e12 uses gge44060(1)

## Placement (name value [footprint] x y rotation side)

## Nets

## Copper pours and planes (outline as drawn; the poured copper is in the pictures)
GND on Top Layer: 54.36,75.12 68.63,75.12 68.63,62.06 54.36,62.06
GND on Top Layer: -39.32,82.43 6.02,82.3 7.67,-4.56 -37.67,-4.82
GND on Bottom Layer: -3.84,83.8 41.5,83.68 43.16,-3.19 -2.18,-3.45

Small or netless copper shapes (teardrops, artwork), in the pictures only: 481 on Bottom Layer

## Text on the board
Bottom Silkscreen Layer: JLCJLCJLCJLC
Top Solder Mask Layer: HELLO | Fingerprint
